# Altium project GD32FOC_V0.1.PrjPcb
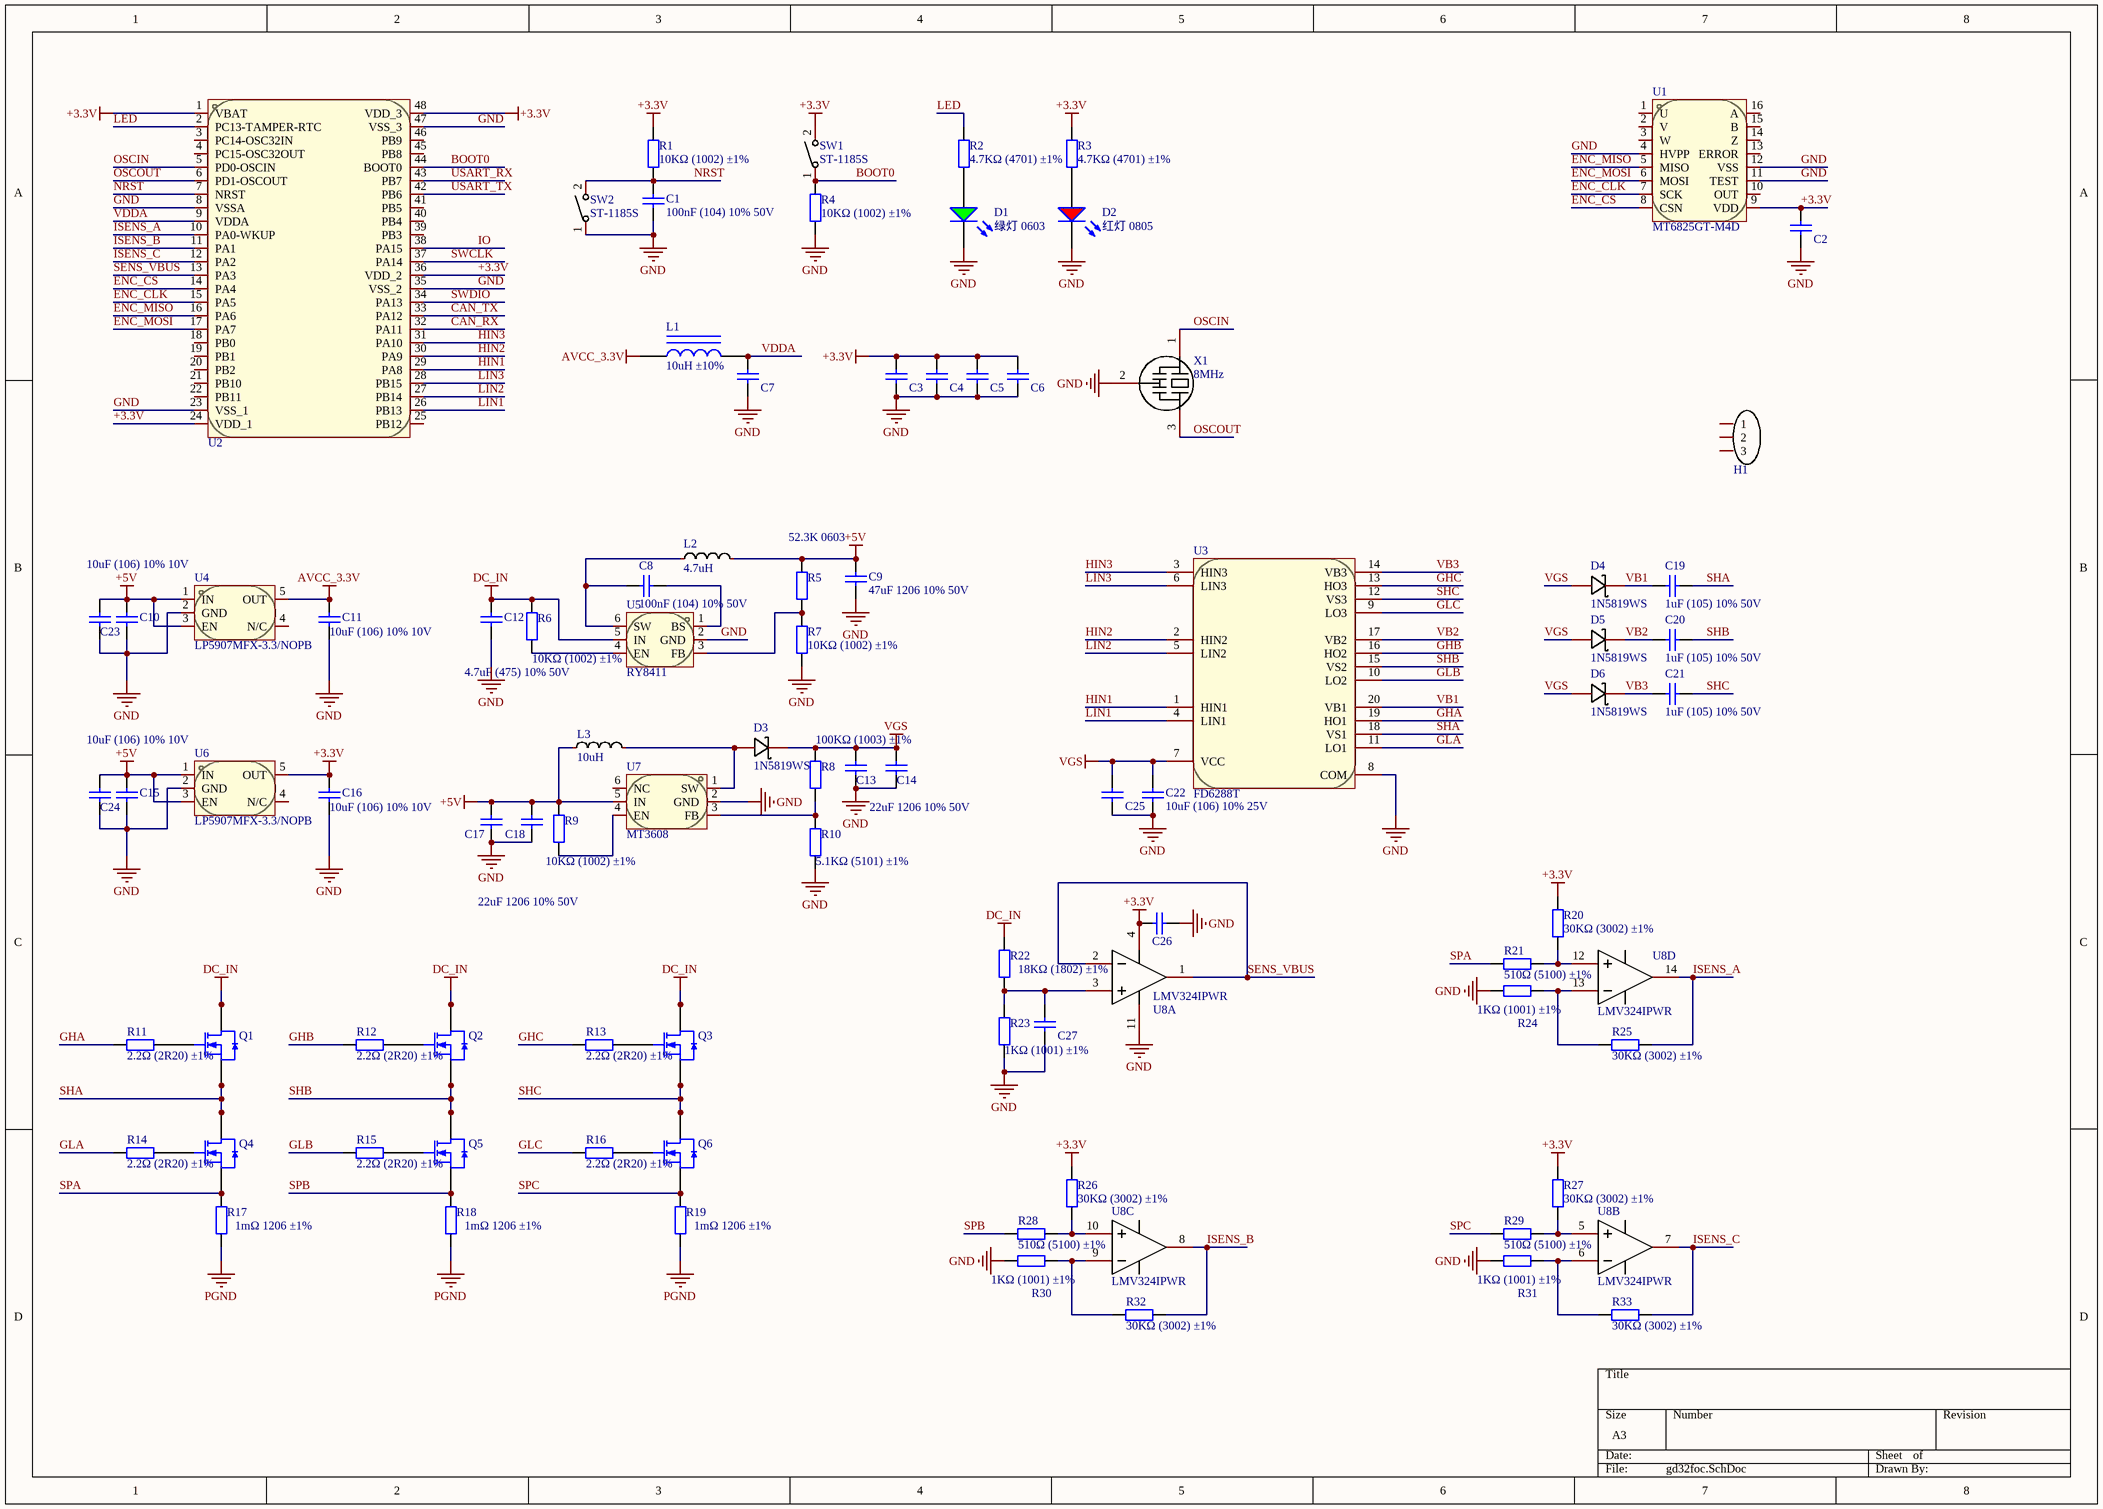
[diagram p0: gd32foc.SchDoc]
1 sheet, 87 parts. Net scope: global (net labels, ports and power ports of the same name join across sheets).
Board file: gd32foc.PcbDoc

## Sheet gd32foc.SchDoc
size A3; SheetNumber: 1; SheetTotal: 1

### Parts
C1  100nF (104) 10% 50V  [0603_C]
C2  100nF (104) 10% 50V  [0603_C]  (value not drawn)
C3  100nF (104) 10% 50V  [0603_C]  (value not drawn)
C4  100nF (104) 10% 50V  [0603_C]  (value not drawn)
C5  100nF (104) 10% 50V  [0603_C]  (value not drawn)
C6  100nF (104) 10% 50V  [0603_C]  (value not drawn)
C7  100nF (104) 10% 50V  [0603_C]  (value not drawn)
C8  100nF (104) 10% 50V  [0603_C]
C9  47uF 1206 10% 50V  [1206_C]
C10  10uF (106) 10% 10V  [0603_C]
C11  10uF (106) 10% 10V  [0603_C]
C12  4.7uF (475) 10% 50V  [1206_C]
C13  22uF 1206 10% 50V  [1206_C]
C14  100nF (104) 10% 50V  [0603_C]  (value not drawn)
C15  10uF (106) 10% 10V  [0603_C]
C16  10uF (106) 10% 10V  [0603_C]
C17  22uF 1206 10% 50V  [1206_C]
C18  100nF (104) 10% 50V  [0603_C]  (value not drawn)
C19  1uF (105) 10% 50V  [0603_C]
C20  1uF (105) 10% 50V  [0603_C]
C21  1uF (105) 10% 50V  [0603_C]
C22  10uF (106) 10% 25V  [0805_C]
C23  100nF (104) 10% 50V  [0603_C]  (value not drawn)
C24  100nF (104) 10% 50V  [0603_C]  (value not drawn)
C25  100nF (104) 10% 50V  [0603_C]  (value not drawn)
C26  100nF (104) 10% 50V  [0603_C]  (value not drawn)
C27  100nF (104) 10% 50V  [0603_C]  (value not drawn)
D1  绿灯 0603  [0603_LED_S1]
D2  红灯 0805  [0805_LED_S1]
D3  1N5819WS  [SOD-323_L1.8-W1.3-LS2.5-RD]
D4  1N5819WS  [SOD-323_L1.8-W1.3-LS2.5-RD]
D5  1N5819WS  [SOD-323_L1.8-W1.3-LS2.5-RD]
D6  1N5819WS  [SOD-323_L1.8-W1.3-LS2.5-RD]
H1  MR30-M  [MR30-M]  (value not drawn)
L1  10uH ±10%  [0603_L]
L2  4.7uH  [IND-SMD_L2.5-W2.0]
L3  10uH  [IND-SMD_L2.5-W2.0_WPN252012H]
Q1  HYG025N06LS1C2  [DFN-8_L5.9-W5.2-P1.27-LS6.2-BL]  (value not drawn)
Q2  HYG025N06LS1C2  [DFN-8_L5.9-W5.2-P1.27-LS6.2-BL]  (value not drawn)
Q3  HYG025N06LS1C2  [DFN-8_L5.9-W5.2-P1.27-LS6.2-BL]  (value not drawn)
Q4  HYG025N06LS1C2  [DFN-8_L5.9-W5.2-P1.27-LS6.2-BL]  (value not drawn)
Q5  HYG025N06LS1C2  [DFN-8_L5.9-W5.2-P1.27-LS6.2-BL]  (value not drawn)
Q6  HYG025N06LS1C2  [DFN-8_L5.9-W5.2-P1.27-LS6.2-BL]  (value not drawn)
R1  10KΩ (1002) ±1%  [0603_R]
R2  4.7KΩ (4701) ±1%  [0603_R]
R3  4.7KΩ (4701) ±1%  [0603_R]
R4  10KΩ (1002) ±1%  [0603_R]
R5  52.3K 0603  [0603_R]
R6  10KΩ (1002) ±1%  [0603_R]
R7  10KΩ (1002) ±1%  [0603_R]
R8  100KΩ (1003) ±1%  [0603_R]
R9  10KΩ (1002) ±1%  [0603_R]
R10  5.1KΩ (5101) ±1%  [0603_R]
R11  2.2Ω (2R20) ±1%  [0603_R]
R12  2.2Ω (2R20) ±1%  [0603_R]
R13  2.2Ω (2R20) ±1%  [0603_R]
R14  2.2Ω (2R20) ±1%  [0603_R]
R15  2.2Ω (2R20) ±1%  [0603_R]
R16  2.2Ω (2R20) ±1%  [0603_R]
R17  1mΩ 1206 ±1%  [1206_R]
R18  1mΩ 1206 ±1%  [1206_R]
R19  1mΩ 1206 ±1%  [1206_R]
R20  30KΩ (3002) ±1%  [0603_R]
R21  510Ω (5100) ±1%  [0603_R]
R22  18KΩ (1802) ±1%  [0603_R]
R23  1KΩ (1001) ±1%  [0603_R]
R24  1KΩ (1001) ±1%  [0603_R]
R25  30KΩ (3002) ±1%  [0603_R]
R26  30KΩ (3002) ±1%  [0603_R]
R27  30KΩ (3002) ±1%  [0603_R]
R28  510Ω (5100) ±1%  [0603_R]
R29  510Ω (5100) ±1%  [0603_R]
R30  1KΩ (1001) ±1%  [0603_R]
R31  1KΩ (1001) ±1%  [0603_R]
R32  30KΩ (3002) ±1%  [0603_R]
R33  30KΩ (3002) ±1%  [0603_R]
SW1  ST-1185S  [SW-SMD_ST-1185S]
SW2  ST-1185S  [SW-SMD_ST-1185S]
U1  MT6825GT-M4D  [TSSOP-16_L5.0-W4.4-P0.65-LS6.4-BL]
U2  GD32C103CBT6  [LQFP-48_L7.0-W7.0-P0.50-LS9.0-BL]  (value not drawn)
U3  FD6288T  [TSSOP-20_L6.5-W4.4-P0.65-LS6.4-BL]
U4  LP5907MFX-3.3/NOPB  [SOT-23-5_L3.0-W1.7-P0.95-LS2.8-BR]
U5  RY8411  [SOT-23-6_L2.9-W1.6-P0.95-LS2.8-TL]
U6  LP5907MFX-3.3/NOPB  [SOT-23-5_L3.0-W1.7-P0.95-LS2.8-BR]
U7  MT3608  [SOT-23-6_L2.9-W1.6-P0.95-LS2.8-BL]
U8  LMV324IPWR  [TSSOP-14_L5.0-W4.4-P0.65-LS6.4-BL]  (parts A,B,C,D of 4)
X1  8MHz  [OSC-SMD_3P-L3.2-W1.3-P1.2-L]

### Nets
+3.3V: C2.2 C3.2 C4.2 C5.2 C6.2 C16.2 C26.2 R1.2 R3.2 R20.2 R26.2 R27.2 SW1.2 U1.9(VDD) U2.1(VBAT) U2.24(VDD_1) U2.36(VDD_2) U2.48(VDD_3) U6.5(OUT) U8.4(VCC+)
+5V: C9.2 C10.2 C15.2 C17.2 C18.2 C23.2 C24.2 L2.2 L3.1 R5.2 R9.2 U4.1(IN) U4.3(EN) U6.1(IN) U6.3(EN) U7.5(IN)
AVCC_3.3V: C11.2 L1.1 U4.5(OUT)
DC_IN: C12.2 Q1.5(D) Q1.6(D) Q1.7(D) Q1.8(D) Q1.9(D) Q2.5(D) Q2.6(D) Q2.7(D) Q2.8(D) Q2.9(D) Q3.5(D) Q3.6(D) Q3.7(D) Q3.8(D) Q3.9(D) R6.2 R22.2 U5.5(IN)
GND: C1.1 C2.1 C3.1 C4.1 C5.1 C6.1 C7.1 C9.1 C10.1 C11.1 C12.1 C13.1 C14.1 C15.1 C16.1 C17.1 C18.1 C22.1 C23.1 C24.1 C25.1 C26.1 C27.1 D1.K D2.K R4.1 R7.1 R10.1 R23.1 R24.1 R30.1 R31.1 SW2.1 U1.4(HVPP) U1.11(TEST) U1.12(VSS) U2.8(VSSA) U2.23(VSS_1) U2.35(VSS_2) U2.47(VSS_3) U3.8(COM) U4.2(GND) U5.2(GND) U6.2(GND) U7.2(GND) U8.11(GND) X1.2(VSS)
PGND: R17.1 R18.1 R19.1
VGS: C13.2 C14.2 C22.2 C25.2 D3.1(K) D4.2(A) D5.2(A) D6.2(A) R8.2 U3.7(VCC)
BOOT0: R4.2 SW1.1 U2.44(BOOT0)
CAN_RX: U2.32(PA11)
CAN_TX: U2.33(PA12)
ENC_CLK: U1.7(SCK) U2.15(PA5)
ENC_CS: U1.8(CSN) U2.14(PA4)
ENC_MISO: U1.5(MISO) U2.16(PA6)
ENC_MOSI: U1.6(MOSI) U2.17(PA7)
GHA: R11.1 U3.19(HO1)
GHB: R12.1 U3.16(HO2)
GHC: R13.1 U3.13(HO3)
GLA: R14.1 U3.11(LO1)
GLB: R15.1 U3.10(LO2)
GLC: R16.1 U3.9(LO3)
HIN1: U2.29(PA8) U3.1(HIN1)
HIN2: U2.30(PA9) U3.2(HIN2)
HIN3: U2.31(PA10) U3.3(HIN3)
IO: U2.38(PA15)
ISENS_A: R25.1 U2.10(PA0-WKUP) U8.14(OUT4)
ISENS_B: R32.1 U2.11(PA1) U8.8(OUT3)
ISENS_C: R33.1 U2.12(PA2) U8.7(OUT2)
LED: R2.2 U2.2(PC13-TAMPER-RTC)
LIN1: U2.26(PB13) U3.4(LIN1)
LIN2: U2.27(PB14) U3.5(LIN2)
LIN3: U2.28(PB15) U3.6(LIN3)
NRST: C1.2 R1.1 SW2.2 U2.7(NRST)
OSCIN: U2.5(PD0-OSCIN) X1.1
OSCOUT: U2.6(PD1-OSCOUT) X1.3
SENS_VBUS: U2.13(PA3) U8.1(OUT1) U8.2(IN1-)
SHA: C19.2 Q1.1(S) Q1.2(S) Q1.3(S) Q4.5(D) Q4.6(D) Q4.7(D) Q4.8(D) Q4.9(D) U3.18(VS1)
SHB: C20.2 Q2.1(S) Q2.2(S) Q2.3(S) Q5.5(D) Q5.6(D) Q5.7(D) Q5.8(D) Q5.9(D) U3.15(VS2)
SHC: C21.2 Q3.1(S) Q3.2(S) Q3.3(S) Q6.5(D) Q6.6(D) Q6.7(D) Q6.8(D) Q6.9(D) U3.12(VS3)
SPA: Q4.1(S) Q4.2(S) Q4.3(S) R17.2 R21.1
SPB: Q5.1(S) Q5.2(S) Q5.3(S) R18.2 R28.1
SPC: Q6.1(S) Q6.2(S) Q6.3(S) R19.2 R29.1
SWCLK: U2.37(PA14)
SWDIO: U2.34(PA13)
USART_RX: U2.43(PB7)
USART_TX: U2.42(PB6)
VB1: C19.1 D4.1(K) U3.20(VB1)
VB2: C20.1 D5.1(K) U3.17(VB2)
VB3: C21.1 D6.1(K) U3.14(VB3)
VDDA: C7.2 L1.2 U2.9(VDDA)
NetC8_1: C8.1 L2.1 U5.6(SW)
NetC8_2: C8.2 U5.1(BS)
NetC27_2: C27.2 R22.1 R23.2 U8.3(IN1+)
NetD1_A: D1.A R2.1
NetD2_A: D2.A R3.1
NetD3_2: D3.2(A) L3.2 U7.1(SW)
NetQ1_4: Q1.4(G) R11.2
NetQ2_4: Q2.4(G) R12.2
NetQ3_4: Q3.4(G) R13.2
NetQ4_4: Q4.4(G) R14.2
NetQ5_4: Q5.4(G) R15.2
NetQ6_4: Q6.4(G) R16.2
NetR5_1: R5.1 R7.2 U5.3(FB)
NetR6_1: R6.1 U5.4(EN)
NetR8_1: R8.1 R10.2 U7.3(FB)
NetR9_1: R9.1 U7.4(EN)
NetR20_1: R20.1 R21.2 U8.12(IN4+)
NetR24_2: R24.2 R25.2 U8.13(IN4-)
NetR26_1: R26.1 R28.2 U8.10(IN3+)
NetR27_1: R27.1 R29.2 U8.5(IN2+)
NetR30_2: R30.2 R32.2 U8.9(IN3-)
NetR31_2: R31.2 R33.2 U8.6(IN2-)

Not connected (* = marked no-connect by the designer): H1 1(3) 2 3(1); U1 1(U) 2(V) 3(W) 10(OUT) 13(ERROR) 14(Z) 15(B) 16(A); U2 3(PC14-OSC32IN) 4(PC15-OSC32OUT) 18(PB0) 19(PB1) 20(PB2) 21(PB10) 22(PB11) 25(PB12) 39(PB3) 40(PB4) 41(PB5) 45(PB8) 46(PB9); U4 4(N/C); U6 4(N/C); U7 6(NC)

### Library data of the parts
C1-C8 C14 C18 C23-C27 = 0603 100nF (104) 10% 50V: 贴片电容; ComponentLink1Description: 供应商链接; ComponentLink1URL: http://www.szlcsc.com/product/details_15331.html; Package: 0603; Supplier: LC; SuppliersPartNumber: C14663
C9 C12 C13 C17 = 1206 4.7uF (475) 10% 50V: 贴片电容; ComponentLink1Description: 供应商链接; ComponentLink1URL: http://www.szlcsc.com/product/details_30577.html; Package: 1206; Supplier: LC; SuppliersPartNumber: C29823
C10 C11 C15 C16 = 0603 10uF (106) 10% 10V: 贴片电容; ComponentLink1Description: 供应商链接; ComponentLink1URL: http://www.szlcsc.com/product/details_20411.html; Package: 0603; Supplier: LC; SuppliersPartNumber: C19702
C19-C21 = 0603 1uF (105) 10% 50V: 贴片电容; ComponentLink1Description: 供应商链接; ComponentLink1URL: http://www.szlcsc.com/product/details_16531.html; Package: 0603; Supplier: LC; SuppliersPartNumber: C15849
C22 = 0805 10uF (106) 10% 25V: 贴片电容; ComponentLink1Description: 供应商链接; ComponentLink1URL: http://www.szlcsc.com/product/details_16532.html; Package: 0805; Supplier: LC; SuppliersPartNumber: C15850
D1 = 0603 绿灯: 发光二极管; ComponentLink1Description: 供应商链接; ComponentLink1URL: http://www.szlcsc.com/product/details_73152.html; Package: 0603; Supplier: LC; SuppliersPartNumber: C72043
D2 = 0805 红灯: 发光二极管; ComponentLink1Description: 供应商链接; ComponentLink1URL: http://www.szlcsc.com/product/details_2668.html; Package: 0805; Supplier: LC; SuppliersPartNumber: C2295
D3-D6 = 1N5819WS_C191023: 正向压降(Vf):600mV@1A;直流反向耐压(Vr):40V;平均整流电流(Io):1A;; Manufacturer: Hottech(合科泰); Add into BOM: yes; Reverse Voltage (Vr): 40V; Average Rectified Current (Io): 1A; Symbol: 1N5819WS; Device: 1N5819WS_C191023; LCSC Part Name: 电压:40V 电流:1A; Supplier Part: C191023; Manufacturer Part: 1N5819WS; Supplier Footprint: SOD-323; JLCPCB Part Class: 基础库; Datasheet: https://atta.szlcsc.com/upload/public/pdf/source/20220428/3CB86FD8D28D653594B4E35F9D5AEFD9.pdf; Supplier: LCSC; Convert to PCB: yes; Forward Voltage (Vf@If): 600mV@1A; Name: 1N5819WS
H1 = MR30-M_卧: Convert to PCB: yes; Check: true; Name: MR30-M; Symbol: MR30-M; Device: MR30-M; Supplier Part: C146690; Supplier: LCSC; Add into BOM: yes; Origin Footprint: MR30-M
L1 = 0603 10uH 10%: 贴片电感; ComponentLink1Description: 供应商链接; ComponentLink1URL: http://www.szlcsc.com/product/details_1387.html; Package: 0603; Supplier: LC; SuppliersPartNumber: C1035
L2 = SWPA252012S4R7MT: 电感值:4.7uH;精度:±20%;额定电流:840mA;类型:-;饱和电流(Isat):1.25A;; Manufacturer: Sunlord(顺络); Add into BOM: yes; Tolerance: ±20%; Rated Current: 840mA; DC Resistance (DCR): 377mΩ; Saturation Current (Isat): 1.25A; Symbol: SWPA252012S4R7MT; Device: SWPA252012S4R7MT; LCSC Part Name: 4.7uH ±20% 1.25A; Supplier Part: C87640; Manufacturer Part: SWPA252012S4R7MT; Supplier Footprint: 1008; JLCPCB Part Class: 扩展库; Datasheet: https://atta.szlcsc.com/upload/public/pdf/source/20231024/317626D2AA2F8AB4113C1875E432E6E1.pdf; Supplier: LCSC; Convert to PCB: yes; Value: 4.7uH; Type: -; Ratings: -; Name: 4.7uH
L3 = WPN252012H100MT: 电感值:10uH;精度:±20%;额定电流:850mA;直流电阻(DCR):480mΩ;; Manufacturer: Sunlord(顺络); Add into BOM: yes; Tolerance: ±20%; Rated Current: 850mA; DC Resistance (DCR): 480mΩ; Symbol: WPN252012H100MT; Device: WPN252012H100MT; LCSC Part Name: 10uH ±20% 850mA 480mΩ; Supplier Part: C98353; Manufacturer Part: WPN252012H100MT; Supplier Footprint: SMD; JLCPCB Part Class: 扩展库; Datasheet: https://atta.szlcsc.com/upload/public/pdf/source/20210916/5D33DED32780FEB7D0AA8BED8FC93477.pdf; Supplier: LCSC; Convert to PCB: yes; Value: 10uH; Name: 10uH
Q1-Q6 = HYG025N06LS1C2: 类型:N沟道;阈值电压(Vgs(th)@Id):2.1V@250uA;漏源电压(Vdss):60V;连续漏极电流(Id):170A;功率(Pd):130W;导通电阻(RDS(on)@Vgs,Id):2.1mΩ@10V,20A;; Manufacturer: HUAYI(华羿微); Add into BOM: yes; Type: N沟道; Drain Source Voltage (Vdss): 60V; Continuous Drain Current (Id): 170A; Power Dissipation (Pd): 130W; Total Gate Charge (Qg@Vgs): 28.2nC@10V; Input Capacitance (Ciss@Vds): 3.915nF@25V; Reverse Transfer Capacitance (Crss@Vds): 10.2pF@25V; Symbol: HYG025N06LS1C2; Device: HYG025N06LS1C2; LCSC Part Name: N沟道 耐压:60V 电流:170A; Supplier Part: C2827231; Manufacturer Part: HYG025N06LS1C2; Supplier Footprint: DFN-8(5x6); JLCPCB Part Class: 扩展库; Datasheet: https://atta.szlcsc.com/upload/public/pdf/source/20210419/C2827231_13841C0339ED96AF58AC5A6C3EF7CB2D.pdf; Supplier: LCSC; Convert to PCB: yes; Gate Threshold Voltage (Vgs(th)@Id): 2.1V@250uA; Drain Source On Resistance (RDS(on)@Vgs,Id): 2.1mΩ@10V,20A; Operating Temperature: +175℃@(Tj); Name: HYG025N06LS1C2
R1 R4 R6 R7 R9 = 0603 10KΩ (1002) 1%: 贴片电阻; ComponentLink1Description: 供应商链接; ComponentLink1URL: http://www.szlcsc.com/product/details_26547.html; Package: 0603; Supplier: LC; SuppliersPartNumber: C25804
R2 R3 = 0603 4.7KΩ (4701) 1%: 贴片电阻; ComponentLink1Description: 供应商链接; ComponentLink1URL: http://www.szlcsc.com/product/details_23889.html; Package: 0603; Supplier: LC; SuppliersPartNumber: C23162
R5 R8 = 0603 100KΩ (1003) 1%: 贴片电阻; ComponentLink1Description: 供应商链接; ComponentLink1URL: http://www.szlcsc.com/product/details_26546.html; Package: 0603; Supplier: LC; SuppliersPartNumber: C25803
R10 = 0603 5.1KΩ (5101) 1%: 贴片电阻; ComponentLink1Description: 供应商链接; ComponentLink1URL: http://www.szlcsc.com/product/details_23913.html; Package: 0603; Supplier: LC; SuppliersPartNumber: C23186
R11-R16 = 0603 2.2Ω (2R20) 1%: 贴片电阻; ComponentLink1Description: 供应商链接; ComponentLink1URL: http://www.szlcsc.com/product/details_23666.html; Package: 0603; Supplier: LC; SuppliersPartNumber: C22939
R17-R19 = 1206 0.1Ω (R100) 1%: 贴片电阻; ComponentLink1Description: 供应商链接; ComponentLink1URL: http://www.szlcsc.com/product/details_26077.html; Package: 1206; Supplier: LC; SuppliersPartNumber: C25334
R20 R25-R27 R32 R33 = 0603 30KΩ (3002) 1%: 贴片电阻; ComponentLink1Description: 供应商链接; ComponentLink1URL: http://www.szlcsc.com/product/details_23711.html; Package: 0603; Supplier: LC; SuppliersPartNumber: C22984
R21 R28 R29 = 0603 510Ω (5100) 1%: 贴片电阻; ComponentLink1Description: 供应商链接; ComponentLink1URL: http://www.szlcsc.com/product/details_23920.html; Package: 0603; Supplier: LC; SuppliersPartNumber: C23193
R22 = 0603 18KΩ (1802) 1%: 贴片电阻; ComponentLink1Description: 供应商链接; ComponentLink1URL: http://www.szlcsc.com/product/details_26553.html; Package: 0603; Supplier: LC; SuppliersPartNumber: C25810
R23 R24 R30 R31 = 0603 1KΩ (1001) 1%: 贴片电阻; ComponentLink1Description: 供应商链接; ComponentLink1URL: http://www.szlcsc.com/product/details_21904.html; Package: 0603; Supplier: LC; SuppliersPartNumber: C21190
SW1 SW2 = ST-1185S: 电路结构:单刀单掷;带支架:否;触点电流:50mA;额定电压(DC):12V;安装方式:立贴;绝缘电阻:100MΩ;机械寿命:10万次;; Manufacturer: RISHENG(日昇); Add into BOM: yes; Circuit: 单刀单掷; Actuator Style: 圆形按钮; Switch Length: 4mm; Switch Width: 3mm; Switch Height: 2mm; Strike Gundam: 否; Contact Current: 50mA; Voltage Rating (DC): 12V; Insulation Resistance: 100MΩ; Actuator/Cap Color: 黑色; Pin Style: SMD接片; Mechanical Life: 10万次; Symbol: ST-1185S; Device: ST-1185S; LCSC Part Name: 4*3*2mm 立贴 轻触开关; Supplier Part: C589191; Manufacturer Part: ST-1185S; Supplier Footprint: SMD; JLCPCB Part Class: 扩展库; Datasheet: https://atta.szlcsc.com/upload/public/pdf/source/20200922/C589191_E74F821EA1C61BCC16EBC99CF1D66EDD.pdf; Supplier: LCSC; Convert to PCB: yes; Mounting Style: 立贴; Operating Temperature: -20℃~+70℃; Name: ST-1185S
U1 = MT6825GT-M4D: AB=2500线，Z=4LSB, UVW=4对极, PWM=1KHz，四线SPI; Manufacturer: MagnTek(麦歌恩); Add into BOM: yes; Symbol: MT6825GT-M4D; Device: MT6825GT-M4D; LCSC Part Name: 零延迟磁角位置传感器IC; Supplier Part: C879563; Manufacturer Part: MT6825GT-M4D; Supplier Footprint: TSSOP-16; JLCPCB Part Class: 扩展库; Datasheet: https://atta.szlcsc.com/upload/public/pdf/source/20230330/FBDF73FB496E85DD4BBCA37A5AE3B195.pdf; Supplier: LCSC; Convert to PCB: yes; Name: MT6825GT-M4D
U2 = GD32C103CBT6: CPU内核:ARM Cortex-M4;CPU最大主频:120MHz;程序存储容量:128KB;程序存储器类型:FLASH;GPIO端口数量:37;工作电压范围:-;RAM总容量:32KB;; Manufacturer: GigaDevice(兆易创新); Add into BOM: yes; CPU Maximum Speed: 120MHz; Program Storage Size: 128KB; Program Memory Type: FLASH; GPIO Ports Number: 37; RAM Size: 32KB; ADC (Bit): 12bit; 16Bit Timer: 13; CAN: 2; UART/USART: 3; Universal Serial Bus: 有; Peripheral/Function: 看门狗；RTC实时时钟; Symbol: GD32C103CBT6; Device: GD32C103CBT6; LCSC Part Name: GD32C103CBT6 带CAN功能; Supplier Part: C2885643; Manufacturer Part: GD32C103CBT6; Supplier Footprint: LQFP-48(7x7); JLCPCB Part Class: 扩展库; Datasheet: https://atta.szlcsc.com/upload/public/pdf/source/20210825/C2885643_F7BB04929325AB1735698A5112B59DA1.pdf; Supplier: LCSC; Convert to PCB: yes; CPU Core: ARM Cortex-M4; Operating Voltage Range: -; EEPROM: -; Operating Temperature Range: -; DAC (Bit): 12bit; PWM (Bit): -; 8Bit Timer: -; 32Bit Timer: -; I2C: 2; I2S: 2; SPI: 3; Internal Comparator: -; communication protocol: -; Watchdog: 有; Real-Time Clock: 有; Infrared Data Association: -; Low-Voltage Detect: -; CCP Capture/Compare: -; Secure Digital Input and Output: -; Direct Memory Access: -; Internal Oscillator: 有
U3 = FD6288T: 三个独立的半桥栅极驱动集成电路芯片; Manufacturer: Fortior Tech(峰岹); Symbol: FD6288; Add into BOM: yes; Device: FD6288T; LCSC Part Name: FD6288T; Supplier Part: C97683; Manufacturer Part: FD6288T; Supplier Footprint: TSSOP-20; JLCPCB Part Class: 扩展库; Datasheet: https://atta.szlcsc.com/upload/public/pdf/source/20180912/C97683_ECE58C9DF7F061C95E95DF4276B152DC.pdf; Supplier: LCSC; Convert to PCB: yes; Name: FD6288T
U4 U6 = LP5907MFX-3.3/NOPB: 输出类型:固定;输出极性:正;最大输入电压:5.5V;输出电压:3.3V;输出电流:250mA;电源纹波抑制比(PSRR):90dB;; Manufacturer: TI(德州仪器); Add into BOM: yes; Output Type: 固定; Output Polarity: 正; Number of Outputs: 1; Maximum Input Voltage: 5.5V; Output Voltage: 3.3V; Dropout Voltage: 250mV@(250mA); Quiescent Current (Ground Current): 25uA; Output Current: 250mA; Power Supply Rejection Ratio (PSRR): 90dB; Symbol: LP5907MFX-3.3/NOPB; Device: LP5907MFX-3.3/NOPB; LCSC Part Name: 输入5.5V 输出3.3V 250mA; Supplier Part: C80670; Manufacturer Part: LP5907MFX-3.3/NOPB; Supplier Footprint: SOT-23-5; JLCPCB Part Class: 扩展库; Datasheet: https://www.ti.com/cn/lit/gpn/lp5907; Supplier: LCSC; Convert to PCB: yes; Operating Temperature: -40℃~+125℃; Name: LP5907MFX-3.3/NOPB
U5 = RY8411_C2935411: Manufacturer: RYCHiP(蕊源); Add into BOM: yes; Symbol: RY8411_C2935411; Device: RY8411_C2935411; LCSC Part Name: RY8411; Supplier Part: C2935411; Manufacturer Part: RY8411; Supplier Footprint: SOT-23-6; JLCPCB Part Class: 扩展库; Datasheet: https://atta.szlcsc.com/upload/public/pdf/source/20211220/DB2E518D79CF9F576C855DA4549CDE87.pdf; Supplier: LCSC; Convert to PCB: yes; Name: RY8411
U7 = MT3608: 功能类型:升压型;输入电压:2V~24V;输出电压:28V;输出电流(最大值):-;; Manufacturer: 西安航天民芯; Add into BOM: yes; Function: 升压型; Number of Outputs: 1; Topology: 升压式; Input Voltage: 2V~24V; Output Voltage: 28V; Switching Frequency: 1.2MHz; Symbol: MT3608; Device: MT3608; LCSC Part Name: 升压型 输入2V~24V 输出28V; Supplier Part: C84817; Manufacturer Part: MT3608; Supplier Footprint: SOT-23-6; JLCPCB Part Class: 扩展库; Datasheet: https://atta.szlcsc.com/upload/public/pdf/source/20161110/1478743351706.pdf; Supplier: LCSC; Convert to PCB: yes; Synchronous Rectification: -; Output Current (Max): -; Name: MT3608
U8 = LMV324IPWR: 放大器组数:-;; Manufacturer: TI(德州仪器); Add into BOM: yes; Symbol: LMV324IPWR; Device: LMV324IPWR; LCSC Part Name: LMV324IPWR; Supplier Part: C398929; Manufacturer Part: LMV324IPWR; Supplier Footprint: TSSOP-14; JLCPCB Part Class: 扩展库; Datasheet: https://atta.szlcsc.com/upload/public/pdf/source/20190618/C398929_636D50FD3555B602F1DEECBEF6440BEF.pdf; Supplier: LCSC; Convert to PCB: yes; Number of Circuits: -; Name: LMV324IPWR
X1 = CSTCE8M00G55-R0: 频率:8MHz;频率公差:±0.5%;内置负载电容:33pF;谐振阻抗:-;; Manufacturer: muRata(村田); Add into BOM: yes; Frequency Tolerance: ±0.5%; Built-in Load Capacitance: 33pF; Frequency Stability: ±0.2%; Symbol: CSTCE8M00G55-R0; Device: CSTCE8M00G55-R0; LCSC Part Name: 8M ±0.5% 33pF 停产 停产; Supplier Part: C70457; Manufacturer Part: CSTCE8M00G55-R0; Supplier Footprint: SMD3213-3P; JLCPCB Part Class: 扩展库; Datasheet: https://atta.szlcsc.com/upload/public/pdf/source/20160405/1459820110334.pdf; Supplier: LCSC; Convert to PCB: yes; Value: 8MHz; Resonant Impedance: -; Operating Temperature: -20℃~+80℃; Name: 8MHz